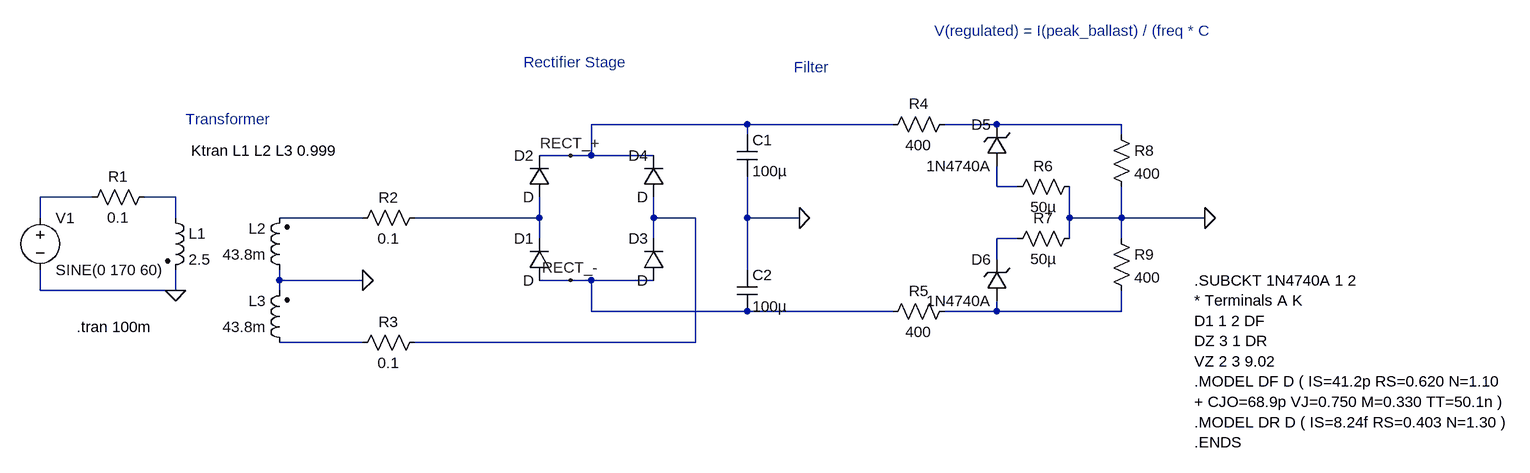
[diagram p0: schematic Lab1a_transformer.asc]
Lab1a_transformer.asc, the LTspice schematic file:
Version 4
SHEET 1 2932 680
WIRE 1328 16 1088 16
WIRE 1552 16 1328 16
WIRE 1712 16 1632 16
WIRE 1904 16 1712 16
WIRE 1328 32 1328 16
WIRE 1904 32 1904 16
WIRE 1056 64 1008 64
WIRE 1088 64 1088 16
WIRE 1088 64 1056 64
WIRE 1184 64 1088 64
WIRE 1712 112 1712 80
WIRE 1744 112 1712 112
WIRE 320 128 240 128
WIRE 448 128 400 128
WIRE 240 160 240 128
WIRE 448 160 448 128
WIRE 736 160 608 160
WIRE 1008 160 1008 128
WIRE 1008 160 816 160
WIRE 1184 160 1184 128
WIRE 1248 160 1184 160
WIRE 1328 160 1328 96
WIRE 1408 160 1328 160
WIRE 1824 160 1824 112
WIRE 1904 160 1904 112
WIRE 1904 160 1824 160
WIRE 2032 160 1904 160
WIRE 1008 192 1008 160
WIRE 1184 192 1184 160
WIRE 1744 192 1712 192
WIRE 1824 192 1824 160
WIRE 1904 192 1904 160
WIRE 1712 224 1712 192
WIRE 1328 240 1328 160
WIRE 608 256 608 240
WIRE 736 256 608 256
WIRE 1056 256 1008 256
WIRE 1088 256 1056 256
WIRE 1184 256 1088 256
WIRE 240 272 240 240
WIRE 448 272 448 240
WIRE 448 272 240 272
WIRE 608 272 608 256
WIRE 1088 304 1088 256
WIRE 1328 304 1088 304
WIRE 1552 304 1328 304
WIRE 1712 304 1712 288
WIRE 1712 304 1632 304
WIRE 1904 304 1904 272
WIRE 1904 304 1712 304
WIRE 736 352 608 352
WIRE 1248 352 1248 160
WIRE 1248 352 816 352
FLAG 736 256 0
FLAG 448 272 0
FLAG 1056 64 RECT_+
FLAG 1056 256 RECT_-
FLAG 1408 160 0
FLAG 2032 160 0
SYMBOL voltage 240 144 R0
WINDOW 123 0 0 Left 0
WINDOW 39 0 0 Left 0
SYMATTR InstName V1
SYMATTR Value SINE(0 170 60)
SYMBOL ind2 432 144 R0
SYMATTR InstName L1
SYMATTR Value 2.5
SYMATTR Type ind
SYMBOL res 416 112 R90
WINDOW 0 0 56 VBottom 2
WINDOW 3 32 56 VTop 2
SYMATTR InstName R1
SYMATTR Value 0.1
SYMBOL res 832 144 R90
WINDOW 0 0 56 VBottom 2
WINDOW 3 32 56 VTop 2
SYMATTR InstName R2
SYMATTR Value 0.1
SYMBOL res 832 336 R90
WINDOW 0 0 56 VBottom 2
WINDOW 3 32 56 VTop 2
SYMATTR InstName R3
SYMATTR Value 0.1
SYMBOL ind2 624 368 R180
WINDOW 0 36 80 Left 2
WINDOW 3 36 40 Left 2
SYMATTR InstName L3
SYMATTR Value 43.8m
SYMATTR Type ind
SYMBOL diode 1024 256 R180
WINDOW 0 24 64 Left 2
WINDOW 3 24 0 Left 2
SYMATTR InstName D1
SYMBOL diode 1024 128 R180
WINDOW 0 24 64 Left 2
WINDOW 3 24 0 Left 2
SYMATTR InstName D2
SYMBOL diode 1200 256 R180
WINDOW 0 24 64 Left 2
WINDOW 3 24 0 Left 2
SYMATTR InstName D3
SYMBOL diode 1200 128 R180
WINDOW 0 24 64 Left 2
WINDOW 3 24 0 Left 2
SYMATTR InstName D4
SYMBOL cap 1312 32 R0
SYMATTR InstName C1
SYMATTR Value 100µ
SYMBOL cap 1312 240 R0
SYMATTR InstName C2
SYMATTR Value 100µ
SYMBOL zener 1728 80 R180
WINDOW 0 24 64 Left 2
WINDOW 3 24 0 Left 2
SYMATTR InstName D5
SYMATTR Value 1N4740A
SYMATTR Prefix X
SYMBOL res 1648 0 R90
WINDOW 0 0 56 VBottom 2
WINDOW 3 32 56 VTop 2
SYMATTR InstName R4
SYMATTR Value 400
SYMBOL res 1648 288 R90
WINDOW 0 0 56 VBottom 2
WINDOW 3 32 56 VTop 2
SYMATTR InstName R5
SYMATTR Value 400
SYMBOL zener 1728 288 R180
WINDOW 0 24 64 Left 2
WINDOW 3 24 0 Left 2
SYMATTR InstName D6
SYMATTR Value 1N4740A
SYMATTR Prefix X
SYMBOL ind2 624 256 R180
WINDOW 0 36 80 Left 2
WINDOW 3 36 40 Left 2
SYMATTR InstName L2
SYMATTR Value 43.8m
SYMATTR Type ind
SYMBOL res 1840 96 R90
WINDOW 0 0 56 VBottom 2
WINDOW 3 32 56 VTop 2
SYMATTR InstName R6
SYMATTR Value 50µ
SYMBOL res 1840 176 R90
WINDOW 0 0 56 VBottom 2
WINDOW 3 32 56 VTop 2
SYMATTR InstName R7
SYMATTR Value 50µ
SYMBOL res 1888 16 R0
SYMATTR InstName R8
SYMATTR Value 400
SYMBOL res 1888 176 R0
SYMATTR InstName R9
SYMATTR Value 400
TEXT 472 56 Left 2 !Ktran L1 L2 L3 0.999
TEXT 296 328 Left 2 !.tran 100m
TEXT 984 -80 Left 2 ;Rectifier Stage
TEXT 464 8 Left 2 ;Transformer
TEXT 1400 -72 Left 2 ;Filter
TEXT 1616 -128 Left 2 ;V(regulated) = I(peak_ballast) / (freq * C
TEXT 2016 256 Left 2 !.SUBCKT 1N4740A 1 2\n* Terminals A K\nD1 1 2 DF\nDZ 3 1 DR\nVZ 2 3 9.02\n.MODEL DF D ( IS=41.2p RS=0.620 N=1.10\n+ CJO=68.9p VJ=0.750 M=0.330 TT=50.1n )\n.MODEL DR D ( IS=8.24f RS=0.403 N=1.30 )\n.ENDS

The netlist it stands for:
* Lab1a_transformer.asc
V1 N003 0 SINE(0 170 60)
L1 N004 0 2.5
R1 N004 N003 0.1
R2 N006 N005 0.1
R3 N007 N010 0.1
L3 N010 0 43.8m
D1 RECT_- N006 D
D2 N006 RECT_+ D
D3 RECT_- N007 D
D4 N007 RECT_+ D
C1 RECT_+ 0 100µ
C2 0 RECT_- 100µ
XD5 N002 N001 1N4740A  ; pins + -
R4 N001 RECT_+ 400
R5 N009 RECT_- 400
XD6 N009 N008 1N4740A  ; pins + -
L2 0 N005 43.8m
R6 0 N002 50µ
R7 0 N008 50µ
R8 N001 0 400
R9 0 N009 400
.model D D
.lib standard.dio
Ktran L1 L2 L3 0.999
.tran 100m
* Rectifier Stage
* Transformer
* Filter
* V(regulated) = I(peak_ballast) / (freq * C
.SUBCKT 1N4740A 1 2
* Terminals A K
D1 1 2 DF
DZ 3 1 DR
VZ 2 3 9.02
.MODEL DF D ( IS=41.2p RS=0.620 N=1.10
+ CJO=68.9p VJ=0.750 M=0.330 TT=50.1n )
.MODEL DR D ( IS=8.24f RS=0.403 N=1.30 )
.ENDS
.backanno
.end